# EAGLE design eurorack-passive-lpg (EAGLE 9.6.2)
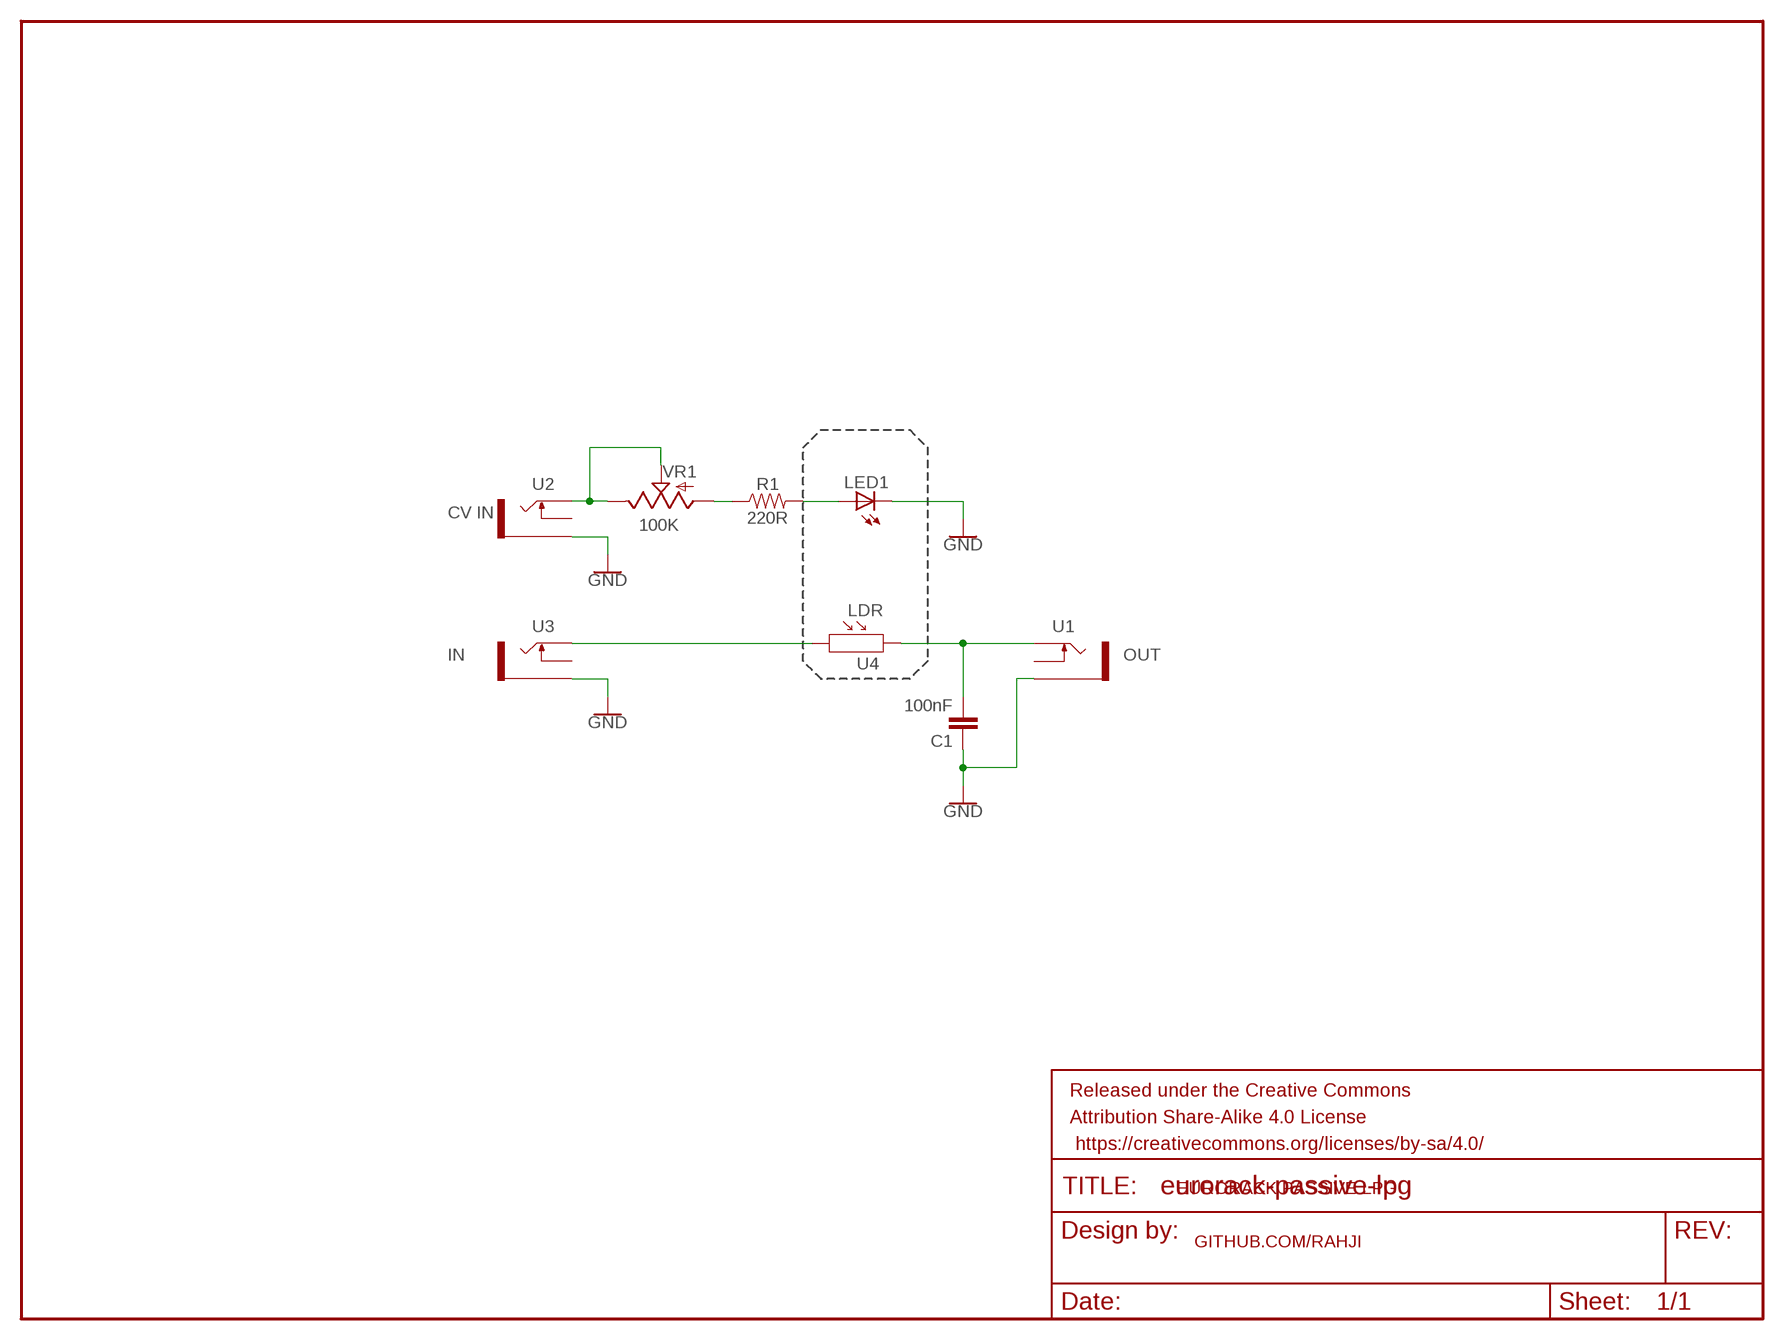
[diagram p0: schematic, sheet 1]

## Parts
C1  100nF  22PF-PTH-2.54MM-200V-5%  [CAP-PTH-2.54]
FRAME1  FRAME-LETTERNO_PACKAGE  [DUMMY]
LED1  LED5MM  [LED5MM]
R1  220R  100OHM-HORIZ-1/4W-1%  [AXIAL-0.3]
U1  OUT  THONKICONNNEW  [WQP-PJ301M-12_JACK]
U2  CV IN  THONKICONNNEW  [WQP-PJ301M-12_JACK]
U3  IN  THONKICONNNEW  [WQP-PJ301M-12_JACK]
U4  LDR  PHOTORESISTOR-5528-10K(2P-5.0X4.2MM)  [SNR2-3.0]
VR1  100K  9MM_SNAP-IN_POT_  [9MM_SNAP-IN_POT]

## Nets
GND: C1.1 LED1.K(C) U1.P$3_SLEEVE(SLEEVE) U2.P$3_SLEEVE(SLEEVE) U3.P$3_SLEEVE(SLEEVE)
N$1: U2.P$1_TIP(TIP) VR1.2(S) VR1.3(E)
N$2: R1.P$1 VR1.1(A)
N$3: U3.P$1_TIP(TIP) U4.1
N$4: LED1.A R1.P$2
N$5: C1.2 U1.P$1_TIP(TIP) U4.2
Unconnected: U1.P$2_SWITCH(SWITCH) U2.P$2_SWITCH(SWITCH) U3.P$2_SWITCH(SWITCH)

## Notes on the sheet
- CV IN
- IN | OUT
- EURORACK PASSIVE LPG
- GITHUB.COM/RAHJI

## Library data of the parts
C1 = SparkFun-Capacitors:22PF: 22pF ceramic capacitors A capacitor is a passive two-terminal electrical component used to store electrical energy temporarily in an electric field.; PROD_ID: CAP-09128; VALUE: 22pF
FRAME1 = SparkFun-Aesthetics:FRAME-LETTER: Schematic Frame - Letter Standard 8.5x11 US Letter frame; DESIGNER: Nobody; VERSION: v01
LED1 = adafruit:LED: LED OSRAM: - CHIPLED LG R971, LG N971, LY N971, LG Q971, LY Q971, LO R971, LY R971 LH N974, LH R974 LS Q976, LO Q976, LY Q976 LO Q996 - Hyper CHIPLED LW Q18S LB Q993, LB Q99A, LB R99A - SideLED LS A670, LO A670, LY A670, LG A670, LP A670 LB A673, LV A673, LT A673, LW A673 LH A674 LY A675 LS A676, LA A676, LO A676, LY A676, LW A676 LS A679, LY A679, LG A679 - Hyper Micro SIDELED® LS Y876, LA Y876, LO Y876, LY Y876 LT Y87S - SmartLED LW L88C, LW L88S LB L89C, LB L89S, LG L890 LS L89K, LO L89K, LY L89K LS L896, LA L896, LO L896, LY L896 - TOPLED LS T670, LO T670, LY T670, LG T670, LP T670 LSG T670, LSP T670, LSY T670, LOP T670, LYG T670 LG T671, LOG T671, LSG T671 LB T673, LV T673, LT T673, LW T673 LH T674 LS T676, LA T676, LO T676, LY T676, LB T676, LH T676, LSB T676, LW T676 LB T67C, LV T67C, LT T67C, LS T67K, LO T67K, LY T67K, LW E67C LS E67B, LA E67B, LO E67B, LY E67B, LB E67C, LV E67C, LT E67C LW T67C LS T679, LY T679, LG T679 LS T770, LO T770, LY T770, LG T770, LP T770 LB T773, LV T773, LT T773, LW T773 LH T774 LS E675, LA E675, LY E675, LS T675 LS T776, LA T776, LO T776, LY T776, LB T776 LHGB T686 LT T68C, LB T68C - Hyper Mini TOPLED® LB M676 - Mini TOPLED Santana® LG M470 LS M47K, LO M47K, LY M47K Source: http://www.osram.convergy.de/
R1 = SparkFun-Resistors:100OHM: 100Ω resistor A resistor is a passive two-terminal electrical component that implements electrical resistance as a circuit element. Resistors act to reduce current flow, and, at the same time, act to lower voltage levels within circuits. - Wikipedia; PROD_ID: RES-12181; VALUE: 100
U1-U3 = MusicThingModular:THONKICONN: 3.5mm socket for Eurorack modular synths
U4 = Seeed-Sensor:PHOTORESISTOR-5528-10K(2P-5.0X4.2MM): 314020017; MPN: PHOTORESISTOR-5528-10K; VALUE: PHOTORESISTOR-5528-10K
VR1 = MusicThingModular:9MM_SNAP-IN_POT: 9mm vertical snap-in pot, Alpha / Panasonic style

## Board
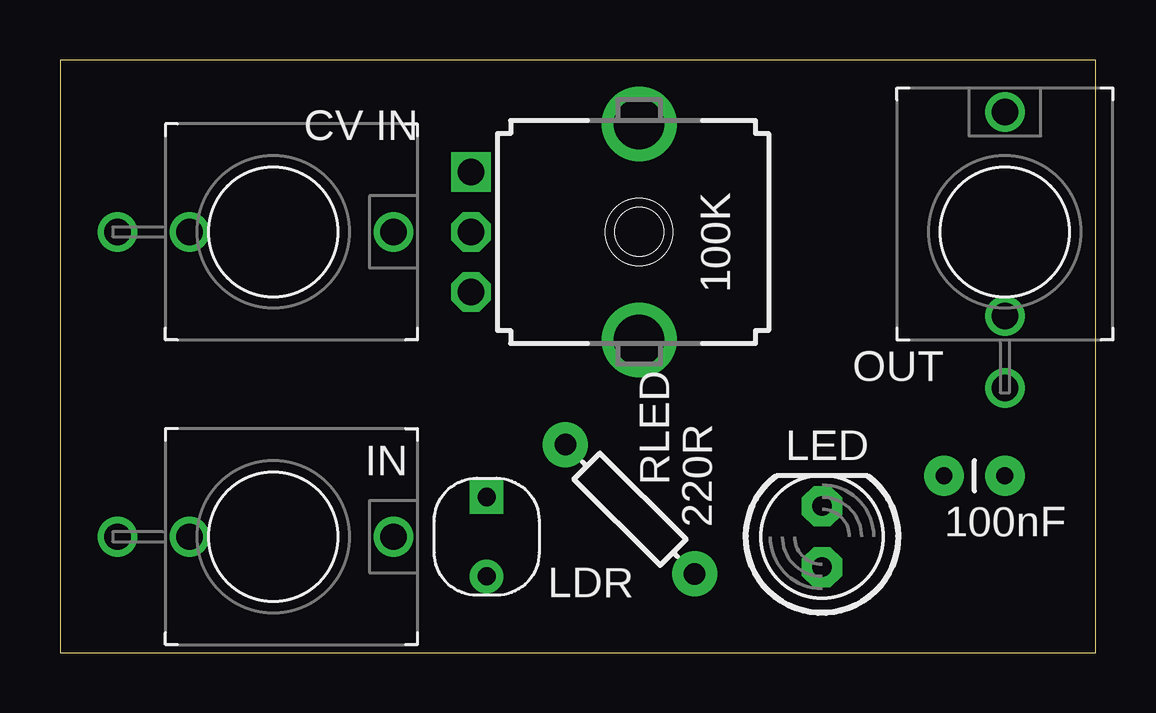
[diagram p1: board, top side]
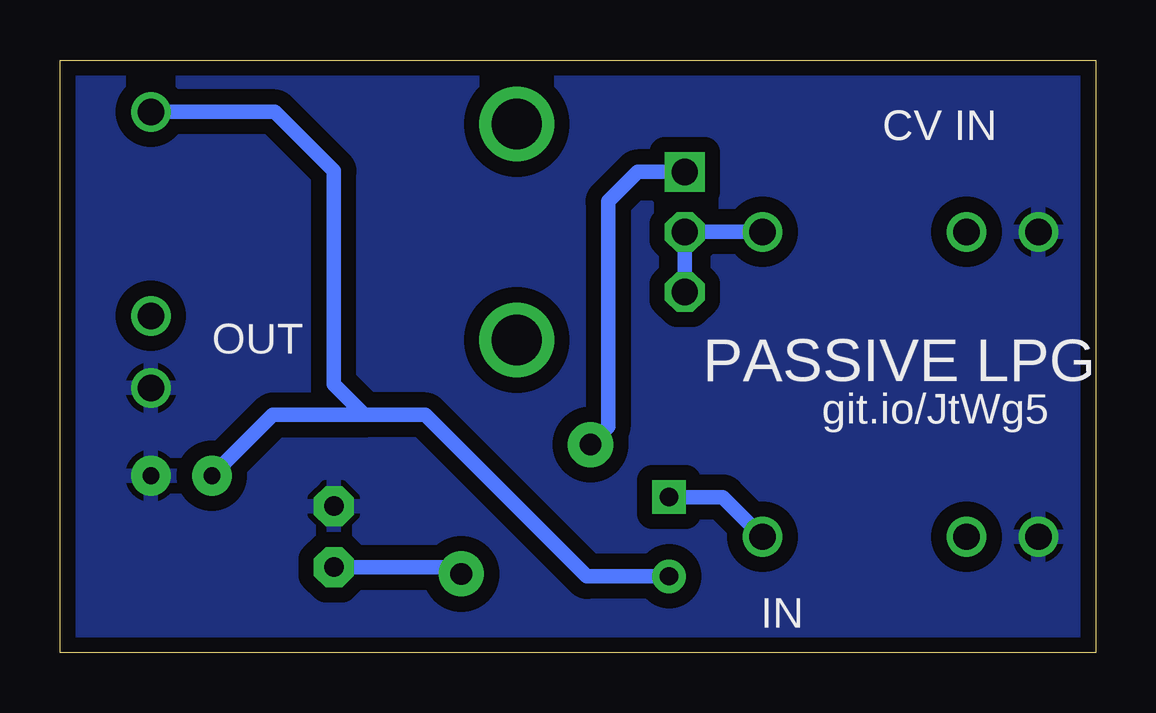
[diagram p2: board, bottom side, seen from below]

Size 43.16 x 24.69 mm. Coordinates in mm from the lower left corner, seen from the top.
Outline: 0,0 43.16,0 43.16,24.69 0,24.69 0,0
Copper layers (1*16): Top 0.0356mm / dielectric 1.5011mm / Bottom 0.0356mm
Design rules "oshpark-2layer": minimum track width 6mil, minimum drill 13mil, track to track 6mil, track to pad 6mil, pad to pad 6mil, via to via 6mil, smd to smd 6mil, copper to edge 15mil, drill to drill 6mil, minimum pad ring 7mil, minimum via ring 7mil, stop-mask expansion 2.5mil, vias tented up to drill 0mil, thermal gap 10mil

### Footprints (pad centres in the part's own frame; a part is rotated, then mirrored left to right if it is on the bottom)
CAP-PTH-2.54 = drill 0.7 pad 1.651: 1 -1.27,0; 2 1.27,0
LED5MM = drill 0.813 pad 1.676 octagon: A -1.27,0; K 1.27,0
AXIAL-0.3 = drill 0.9 pad 1.88: P$1 -3.81,0; P$2 3.81,0
WQP-PJ301M-12_JACK = drill 1.1: P$1_TIP 0,5; P$2_SWITCH 0,-3.5; P$3_SLEEVE 0,-6.5
SNR2-3.0 = drill 0.762 pad 1.397 square: 1 -1.651,0 | drill 0.762 pad 1.397: 2 1.651,0
9MM_SNAP-IN_POT = drill 1.1 square: 1 -2.5,-7 | drill 1.1 octagon: 2 0,-7; 3 2.5,-7 | drill 2.1 pad 2.794: CHASSIS1 -4.5,0; CHASSIS2 4.5,0

### Placement (x,y rotation side)
C1  38.1,7.37 180 top
FRAME1  0,-1.52 0 top
LED1  31.75,4.83 90 top
R1  23.75,5.97 315 top
U1  39.37,17.53 0 top
U2  8.89,17.53 270 top
U3  8.89,4.83 270 top
U4  17.78,4.83 270 top
VR1  24.13,17.53 270 top

### Tracks (layer width: path | path; a pad name or v marks a point on that pad's centre or on a via)
GND
  pour Bottom (isolate 0.635): 0,25.15 45.72,25.15 45.72,-1.52 0,-1.52
N$1
  Bottom 0.61: U2.P$1_TIP VR1.2 VR1.3
N$2
  Bottom 0.61: VR1.1 19.09,20.03 20.32,18.8 20.32,9.4 R1.P$1
N$3
  Bottom 0.61: U3.P$1_TIP 15.54,6.48 U4.1
N$4
  Bottom 0.61: R1.P$2 26.72,3.56 LED1.A
N$5
  Bottom 0.61: U4.2 21.21,3.17 27.94,9.91 30.48,9.91 | 30.48,9.91 34.29,9.91 C1.2 | 30.48,9.91 31.75,11.18 31.75,20.07 34.21,22.53 U1.P$1_TIP

### Text on the board
bPlace: PASSIVE LPG
tNames: CV IN | 100K | OUT | 220R | IN | LED | RLED | 100nF | LDR
bNames: CV IN | OUT | git.io/JtWg5 | IN